# EAGLE design alu (EAGLE 9.5.1)
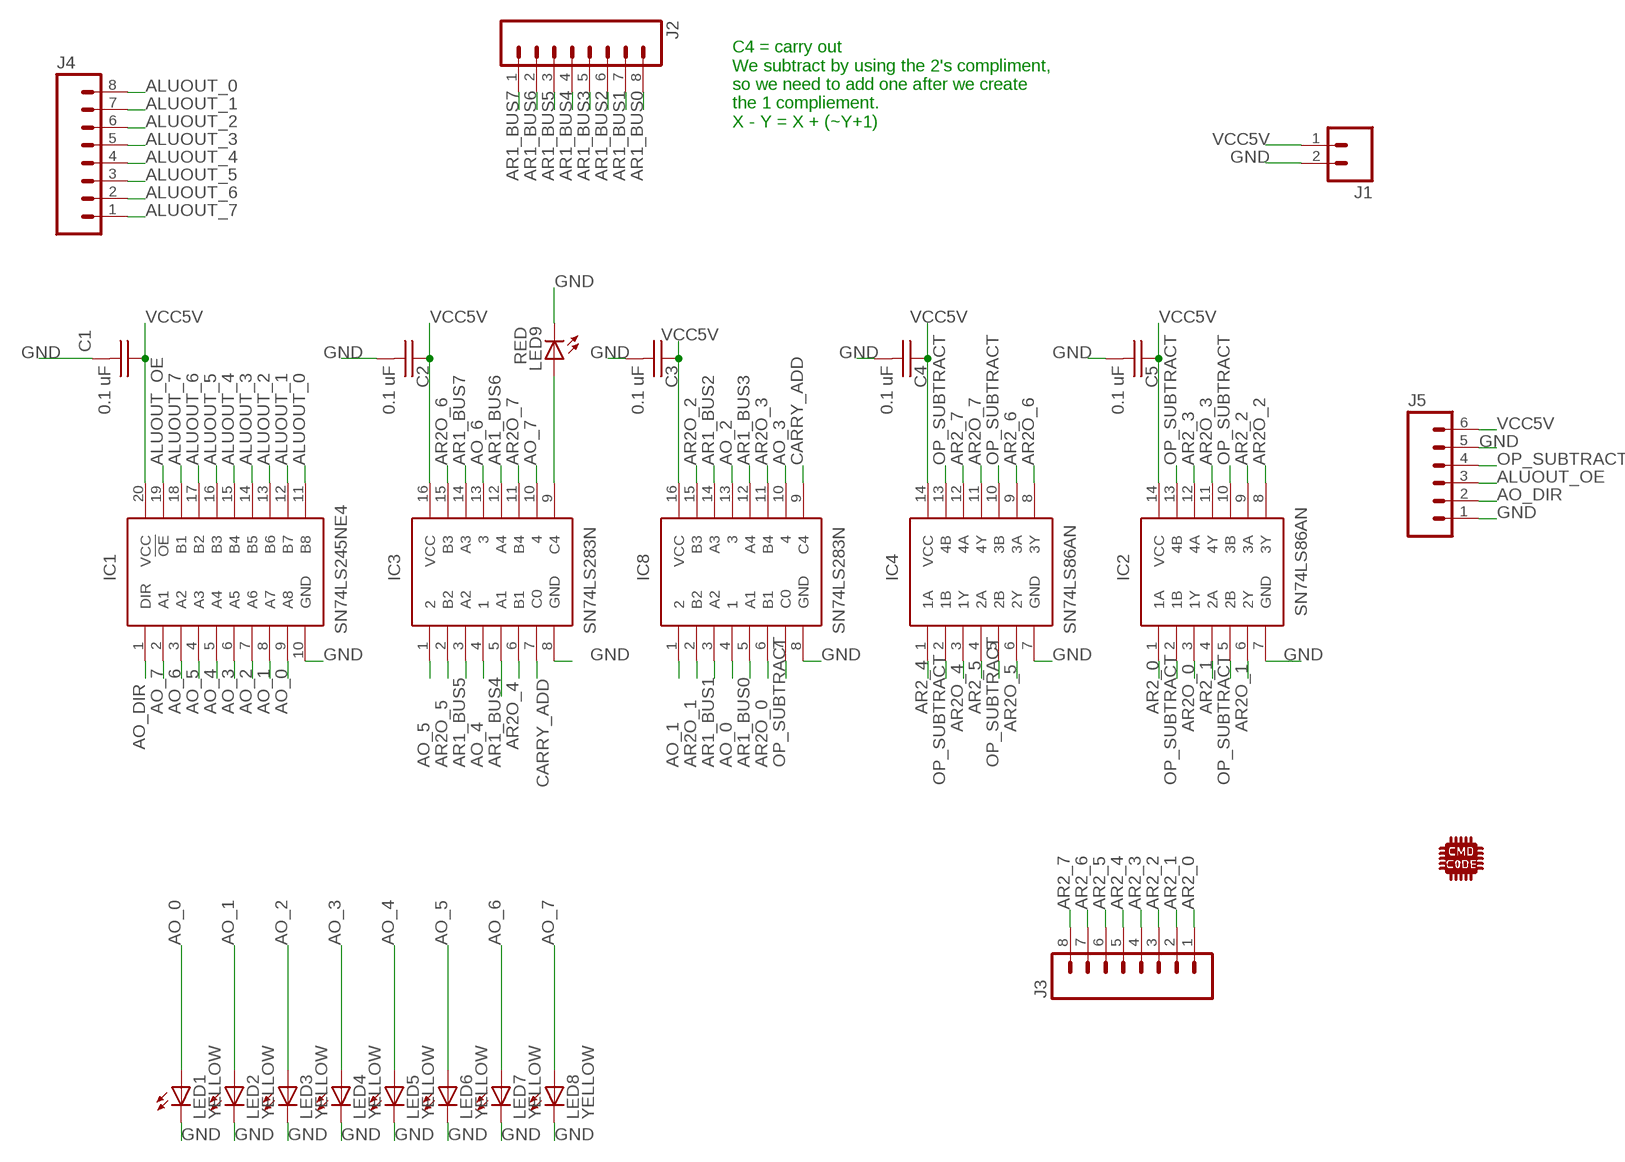
[diagram p0: schematic, sheet 1]

## Parts
C1  0.1 uF  C-US050-025X075  [C050-025X075]
C2  0.1 uF  C-US050-025X075  [C050-025X075]
C3  0.1 uF  C-US050-025X075  [C050-025X075]
C4  0.1 uF  C-US050-025X075  [C050-025X075]
C5  0.1 uF  C-US050-025X075  [C050-025X075]
IC1  SN74LS245NE4  [DIP794W53P254L2540H508Q20N]
IC2  SN74LS86AN  [DIP254P762X508-14]
IC3  SN74LS283N  [DIP254P762X508-16]
IC4  SN74LS86AN  [DIP254P762X508-14]
IC8  SN74LS283N  [DIP254P762X508-16]
J1  M02PTH  [1X02]
J2  M08SILK_FEMALE_PTH  [1X08]
J3  M08SILK_FEMALE_PTH  [1X08]
J4  M08SILK_FEMALE_PTH  [1X08]
J5  M06SILK_FEMALE_PTH  [1X06]
LED1  YELLOW  LED-3MM-NO_SILK  [LED3MM-NS]
LED2  YELLOW  LED-3MM-NO_SILK  [LED3MM-NS]
LED3  YELLOW  LED-3MM-NO_SILK  [LED3MM-NS]
LED4  YELLOW  LED-3MM-NO_SILK  [LED3MM-NS]
LED5  YELLOW  LED-3MM-NO_SILK  [LED3MM-NS]
LED6  YELLOW  LED-3MM-NO_SILK  [LED3MM-NS]
LED7  YELLOW  LED-3MM-NO_SILK  [LED3MM-NS]
LED8  YELLOW  LED-3MM-NO_SILK  [LED3MM-NS]
LED9  RED  LED-3MM-NO_SILK  [LED3MM-NS]
U$1  CMD_C0DE_LOGOCMD_CODE_LOGO_TOP_COPPER  [CMD_C0DE_LOGO_TOP_COPPER]

## Nets
ALUOUT_0: IC1.11(B8) J4.8
ALUOUT_1: IC1.12(B7) J4.7
ALUOUT_2: IC1.13(B6) J4.6
ALUOUT_3: IC1.14(B5) J4.5
ALUOUT_4: IC1.15(B4) J4.4
ALUOUT_5: IC1.16(B3) J4.3
ALUOUT_6: IC1.17(B2) J4.2
ALUOUT_7: IC1.18(B1) J4.1
ALUOUT_OE: IC1.19(!OE) J5.3
AO_0: IC1.9(A8) IC8.4 LED1.A
AO_1: IC1.8(A7) IC8.1 LED2.A
AO_2: IC1.7(A6) IC8.13 LED3.A
AO_3: IC1.6(A5) IC8.10 LED4.A
AO_4: IC1.5(A4) IC3.4 LED5.A
AO_5: IC1.4(A3) IC3.1 LED6.A
AO_6: IC1.3(A2) IC3.13 LED7.A
AO_7: IC1.2(A1) IC3.10 LED8.A
AO_DIR: IC1.1(DIR) J5.2
AR1_BUS0: IC8.5(A1) J2.8
AR1_BUS1: IC8.3(A2) J2.7
AR1_BUS2: IC8.14(A3) J2.6
AR1_BUS3: IC8.12(A4) J2.5
AR1_BUS4: IC3.5(A1) J2.4
AR1_BUS5: IC3.3(A2) J2.3
AR1_BUS6: IC3.12(A4) J2.2
AR1_BUS7: IC3.14(A3) J2.1
AR2_0: IC2.1(1A) J3.1
AR2_1: IC2.4(2A) J3.2
AR2_2: IC2.9(3A) J3.3
AR2_3: IC2.12(4A) J3.4
AR2_4: IC4.1(1A) J3.5
AR2_5: IC4.4(2A) J3.6
AR2_6: IC4.9(3A) J3.7
AR2_7: IC4.12(4A) J3.8
AR2O_0: IC2.3(1Y) IC8.6(B1)
AR2O_1: IC2.6(2Y) IC8.2(B2)
AR2O_2: IC2.8(3Y) IC8.15(B3)
AR2O_3: IC2.11(4Y) IC8.11(B4)
AR2O_4: IC3.6(B1) IC4.3(1Y)
AR2O_5: IC3.2(B2) IC4.6(2Y)
AR2O_6: IC3.15(B3) IC4.8(3Y)
AR2O_7: IC3.11(B4) IC4.11(4Y)
CARRY_ADD: IC3.7(C0) IC8.9(C4)
GND: C1.2 C2.2 C3.2 C4.2 C5.2 IC1.10(GND) IC2.7(GND) IC3.8(GND) IC4.7(GND) IC8.8(GND) J1.2 J5.1 J5.5 LED1.K(C) LED2.K(C) LED3.K(C) LED4.K(C) LED5.K(C) LED6.K(C) LED7.K(C) LED8.K(C) LED9.K(C)
N$10: IC3.9(C4) LED9.A
OP_SUBTRACT: IC2.2(1B) IC2.5(2B) IC2.10(3B) IC2.13(4B) IC4.2(1B) IC4.5(2B) IC4.10(3B) IC4.13(4B) IC8.7(C0) J5.4
VCC5V: C1.1 C2.1 C3.1 C4.1 C5.1 IC1.20(VCC) IC2.14(VCC) IC3.16(VCC) IC4.14(VCC) IC8.16(VCC) J1.1 J5.6

## Notes on the sheet
- C4 = carry out
  We subtract by using the 2's compliment, 
  so we need to add one after we create 
  the 1 compliement. 
  X - Y = X + (~Y+1)

## Library data of the parts
C1-C5 = passives:C-US: CAPACITOR, American symbol
IC1 = ICs:SN74LS245NE4: Bus Transceivers Octal bus Transceiver Source: Datasheet <http://www.ti.com/lit/ds/symlink/sn74ls245.pdf>; DESCRIPTION: Bus Transceivers Octal bus Transceiver; HEIGHT: 5.08mm; MANUFACTURER_NAME: Texas Instruments; MANUFACTURER_PART_NUMBER: SN74LS245NE4; MOUSER_PART_NUMBER: 595-SN74LS245NE4; MOUSER_PRICE-STOCK: https://www.mouser.com/Search/Refine.aspx?Keyword=595-SN74LS245NE4
IC2 IC4 = ICs:SN74LS86AN: QUADRUPLE 2-INPUT EXCLUSIVE-OR GATES Source: Datasheet <http://componentsearchengine.com/Datasheets/1/SN74LS86AN.pdf>; DESCRIPTION: QUADRUPLE 2-INPUT EXCLUSIVE-OR GATES; HEIGHT: mm; MANUFACTURER_NAME: Texas Instruments; MANUFACTURER_PART_NUMBER: SN74LS86AN; MOUSER_PART_NUMBER: 595-SN74LS86AN; MOUSER_PRICE-STOCK: https://www.mouser.com/Search/Refine.aspx?Keyword=595-SN74LS86AN; RS_PART_NUMBER: 3686641; RS_PRICE-STOCK: http://uk.rs-online.com/web/p/products/3686641
IC3 IC8 = ICs:SN74LS283N: 4-BIT BINARY FULL ADDERS WITH FASR CARRY Source: Datasheet <http://www.ti.com/lit/gpn/sn74ls283>; DESCRIPTION: 4-BIT BINARY FULL ADDERS WITH FASR CARRY; HEIGHT: mm; MANUFACTURER_NAME: Texas Instruments; MANUFACTURER_PART_NUMBER: SN74LS283N; MOUSER_PART_NUMBER: 595-SN74LS283N; MOUSER_PRICE-STOCK: https://www.mouser.com/Search/Refine.aspx?Keyword=595-SN74LS283N; RS_PART_NUMBER: 0309212; RS_PRICE-STOCK: http://uk.rs-online.com/web/p/products/0309212
J1 = connector:M02: Standard 2-pin 0.1" header. Use with - straight break away headers ( PRT-00116) - right angle break away headers (PRT-00553) - swiss pins (PRT-00743) - machine pins (PRT-00117) - female headers (PRT-00115) Molex polarized connector foot print use with: PRT-08233 with associated crimp pins and housings. 2.54_SCREWTERM for use with PRT-10571. 3.5mm Screw Terminal footprints for PRT-08084 5mm Screw Terminal footprints for use with PRT-08432
J2-J4 = connector:M08: Header 8 Standard 8-pin 0.1" header. Use with straight break away headers (SKU : PRT-00116), right angle break away headers (PRT-00553), swiss pins (PRT-00743), machine pins (PRT-00117), and female headers (PRT-00115).; PROD_ID: CONN-08438
J5 = connector:M06: Header 6 Standard 6-pin 0.1" header. Use with straight break away headers (SKU : PRT-00116), right angle break away headers (PRT-00553), swiss pins (PRT-00743), machine pins (PRT-00117), and female headers (PRT-00115). Molex polarized connector foot print use with SKU : PRT-08094 with associated crimp pins and housings. NOTES ON THE VARIANTS LOCK and LOCK_LONGPADS... This footprint was designed to help hold the alignment of a through-hole component (i.e. 6-pin header) while soldering it into place. You may notice that each hole has been shifted either up or down by 0.005 of an inch from it's more standard position (which is a perfectly straight line). This slight alteration caused the pins (the squares in the middle) to touch the edges of the holes. Because they are alternating, it causes a "brace" to hold the component in place. 0.005 has proven to be the perfect amount of "off-center" position when using our standard breakaway headers. Although looks a little odd when you look at the bare footprint, once you have a header in there, the alteration is very hard to notice. Also,if you push a header all the way into place, it is covered up entirely on the bottom side. This idea of altering the position of holes to aid alignment will be further integrated into the Sparkfun Library for other footprints. It can help hold any component with 3 or more connection pins.; PROD_ID: CONN-08437
LED1-LED9 = leds:LED: LEDs Standard schematic elements and footprints for 5mm, 3mm, 1206, and 0603 sized LEDs. 5mm - Spark Fun Electronics SKU : COM-00529 (and others)
U$1 = logos:CMD_C0DE_LOGO

## Board
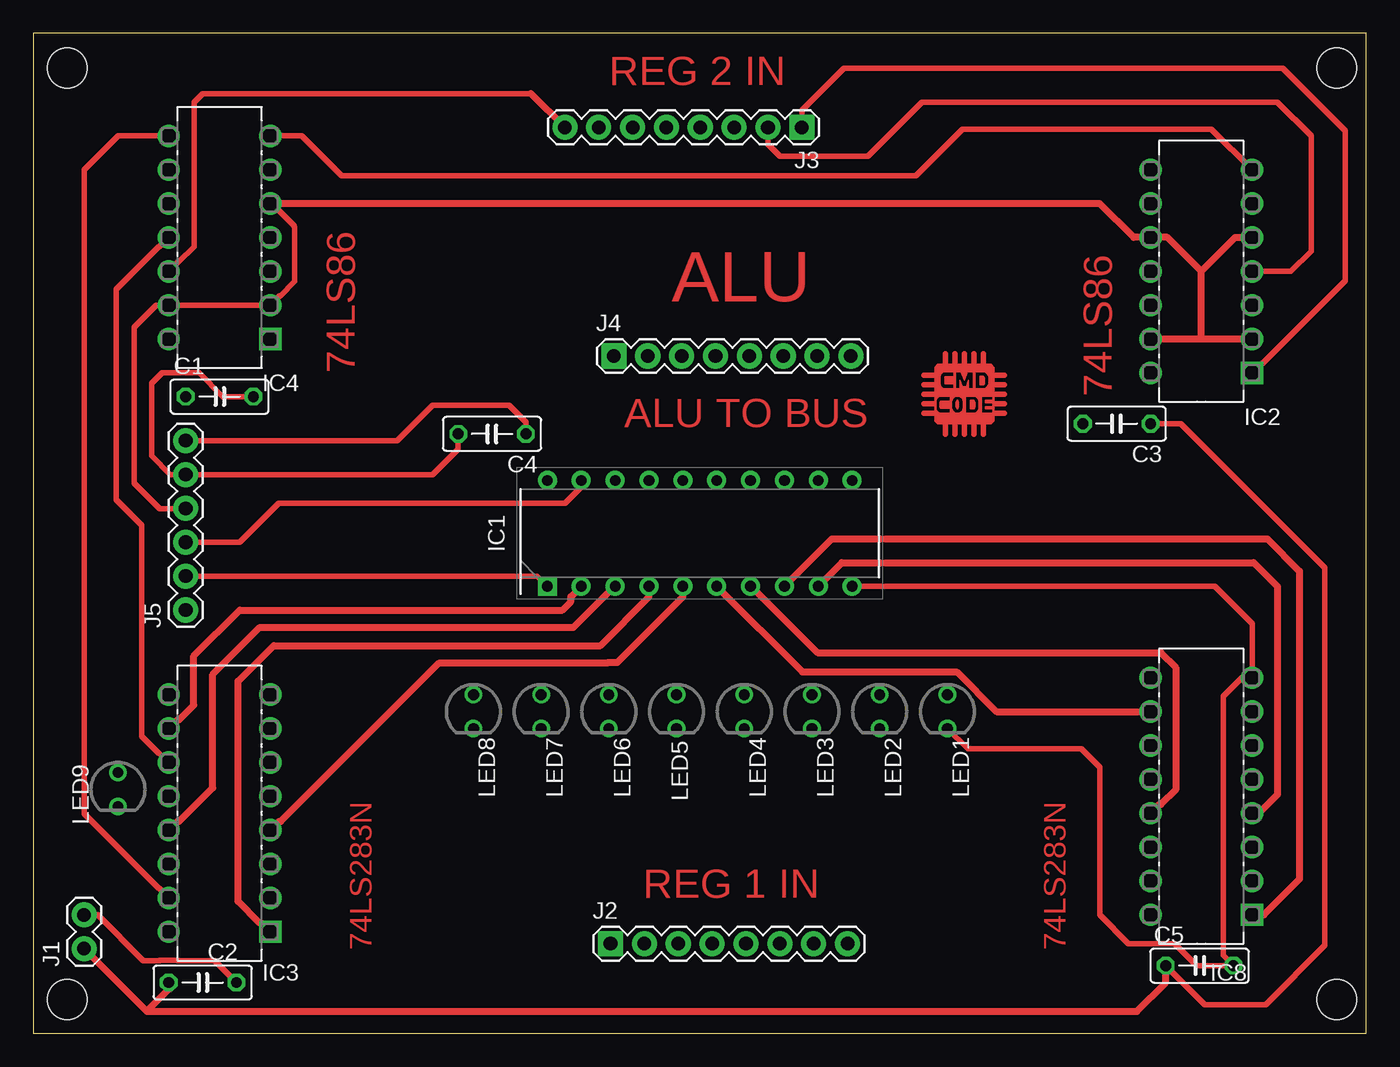
[diagram p1: board, top side]
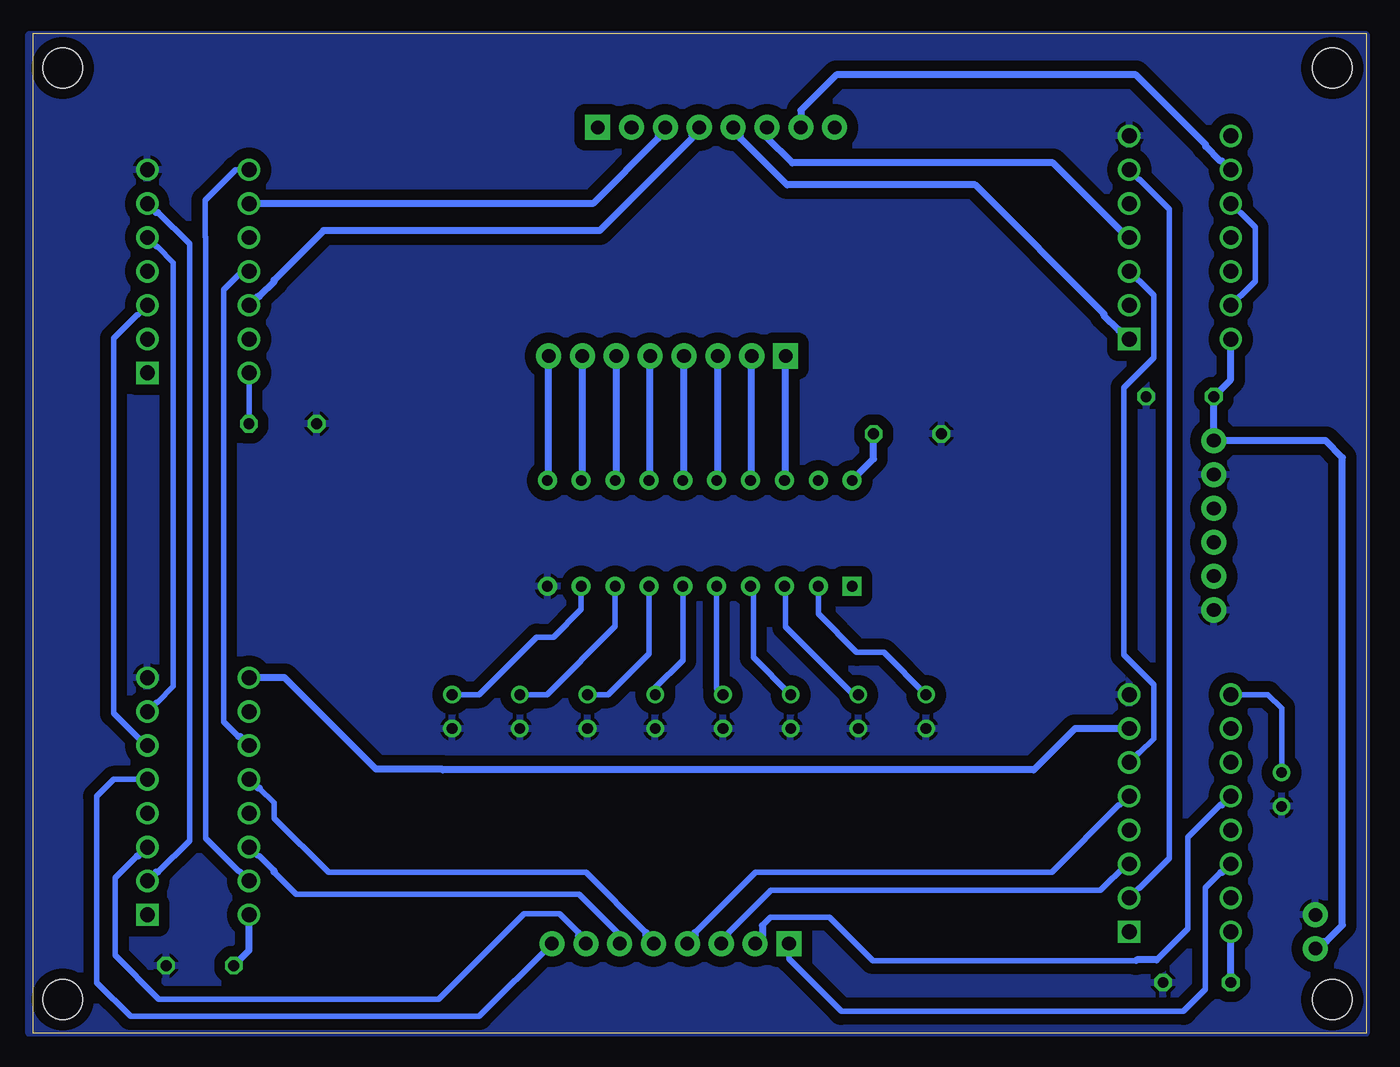
[diagram p2: board, bottom side, seen from below]

Size 100 x 75 mm. Coordinates in mm from the lower left corner, seen from the top.
Outline: 0,0 100,0 100,75 0,75 0,0
Copper layers (1*16): Top 0.035mm / dielectric 1.5mm / Bottom 0.035mm
Design rules "bantam-1-32-dadandson": minimum track width 0.4mm, minimum drill 0.8mm, track to track 0.794003125mm, track to pad 0.794003125mm, pad to pad 0.256540625mm, via to via 0.256540625mm, smd to smd 0mil, copper to edge 0mil, drill to drill 1mil, minimum pad ring 10mil, minimum via ring 10mil, stop-mask expansion 1mil, vias tented up to drill 30mil, thermal gap 10mil
Holes 3 mm at 2.54,2.54 2.54,72.39 97.79,72.39 97.79,2.54

### Footprints (pad centres in the part's own frame; a part is rotated, then mirrored left to right if it is on the bottom)
C050-025X075 = drill 0.813 octagon: 1 -2.54,0; 2 2.54,0
DIP794W53P254L2540H508Q20N = drill 0.8 pad 1.422 square: 1 -3.97,11.43 | drill 0.8 pad 1.422: 2 -3.97,8.89; 3 -3.97,6.35; 4 -3.97,3.81; 5 -3.97,1.27; 6 -3.97,-1.27; 7 -3.97,-3.81; 8 -3.97,-6.35; 9 -3.97,-8.89; 10 -3.97,-11.43; 11 3.97,-11.43; 12 3.97,-8.89; 13 3.97,-6.35; 14 3.97,-3.81; 15 3.97,-1.27; 16 3.97,1.27; 17 3.97,3.81; 18 3.97,6.35; 19 3.97,8.89; 20 3.97,11.43
DIP254P762X508-14 = drill 1.118 pad 1.676 square: 1 -7.62,15.24 | drill 1.118 pad 1.676: 2 -7.62,12.7; 3 -7.62,10.16; 4 -7.62,7.62; 5 -7.62,5.08; 6 -7.62,2.54; 7 -7.62,0; 8 0,0; 9 0,2.54; 10 0,5.08; 11 0,7.62; 12 0,10.16; 13 0,12.7; 14 0,15.24
DIP254P762X508-16 = drill 1.118 pad 1.676 square: 1 -7.62,17.78 | drill 1.118 pad 1.676: 2 -7.62,15.24; 3 -7.62,12.7; 4 -7.62,10.16; 5 -7.62,7.62; 6 -7.62,5.08; 7 -7.62,2.54; 8 -7.62,0; 9 0,0; 10 0,2.54; 11 0,5.08; 12 0,7.62; 13 0,10.16; 14 0,12.7; 15 0,15.24; 16 0,17.78
1X02 = drill 1.016 pad 1.88: 1 0,0; 2 2.54,0
1X08 = drill 1.016 pad 1.88 square: 1 0,0 | drill 1.016 pad 1.88: 2 2.54,0; 3 5.08,0; 4 7.62,0; 5 10.16,0; 6 12.7,0; 7 15.24,0; 8 17.78,0
1X06 = drill 1.016 pad 1.88: 1 0,0; 2 2.54,0; 3 5.08,0; 4 7.62,0; 5 10.16,0; 6 12.7,0
LED3MM-NS = drill 0.813: A -1.27,0; K 1.27,0

### Placement (x,y rotation side)
C1  13.97,47.75 0 top
C2  12.7,3.81 0 top
C3  81.28,45.72 180 top
C4  34.42,44.96 180 top
C5  87.5,5.08 0 top
IC1  50,37.5 90 top
IC2  83.82,64.77 180 top
IC3  10.16,25.4 180 top
IC4  10.16,67.31 180 top
IC8  83.82,26.67 180 top
J1  3.81,6.35 90 top
J2  43.31,6.73 0 top
J3  57.66,67.94 180 top
J4  43.56,50.8 0 top
J5  11.43,31.75 90 top
LED1  68.58,24.13 270 top
LED2  63.5,24.13 270 top
LED3  58.42,24.13 270 top
LED4  53.34,24.13 270 top
LED5  48.26,24.13 270 top
LED6  43.18,24.13 270 top
LED7  38.1,24.13 270 top
LED8  33.02,24.13 270 top
LED9  6.35,18.29 270 top
U$1  69.85,48.26 0 top

### Tracks (layer width: path | path; a pad name or v marks a point on that pad's centre or on a via)
ALUOUT_0
  Bottom 0.508: IC1.11 61.34,41.56 J4.8
ALUOUT_1
  Bottom 0.508: IC1.12 58.8,41.56 J4.7
ALUOUT_2
  Bottom 0.508: IC1.13 56.26,41.56 J4.6
ALUOUT_3
  Bottom 0.508: IC1.14 53.72,41.56 J4.5
ALUOUT_4
  Bottom 0.508: IC1.15 51.18,41.56 J4.4
ALUOUT_5
  Bottom 0.508: IC1.16 48.64,41.56 J4.3
ALUOUT_6
  Bottom 0.508: IC1.17 46.1,41.56 J4.2
ALUOUT_7
  Bottom 0.508: IC1.18 43.56,41.56 J4.1
ALUOUT_OE
  Top 0.4: J5.3 15.49,36.83 18.41,39.75 39.9,39.75 41.11,40.96
  Top 0.406: IC1.19 41.11,40.96
AO_0
  Top 0.508: IC1.9 60.67,35.31 91.57,35.31 93.34,33.53 93.34,17.91 91.95,16.51 IC8.4
  Bottom 0.406: LED1.A 66.55,25.4 62.23,29.72 60.96,29.72 58.89,31.79 IC1.9
AO_1
  Top 0.508: IC1.8 59.9,37.08 92.58,37.08 95,34.67 95,11.56 92.33,8.89 IC8.1
  Bottom 0.406: LED2.A 61.47,25.4 56.35,30.52 IC1.8
AO_2
  Top 0.508: IC1.7 53.86,33.53 58.84,28.56 84.6,28.56 85.71,27.45 85.71,18.27 84.6,17.16 84.47,17.16 IC8.13
  Bottom 0.406: LED3.A 56.9,25.4 53.81,28.49 IC1.7
AO_3
  Top 0.508: IC1.6 57.69,27.11 69.29,27.11 72.27,24.13 IC8.10
  Bottom 0.406: LED4.A 53.34,25.91 51.27,27.98 IC1.6
AO_4
  Top 0.508: IC3.4 18.43,15.89 18.56,15.89 30.45,27.78 43.08,27.78 43.12,27.81 43.81,27.81 48.73,32.73 IC1.5
  Bottom 0.406: LED5.A 48.73,25.87 IC1.5
AO_5
  Top 0.508: IC3.1 17.13,8.27 17,8.27 15.37,9.9 15.37,26.42 18.03,29.08 42.55,29.08 46.19,32.73 IC1.4
  Bottom 0.406: LED6.A 45.97,28.19 45.97,33.31 IC1.4
AO_6
  Top 0.508: IC3.13 10.81,15.89 10.94,15.89 13.46,18.41 13.46,26.92 16.99,30.45 40.52,30.45 43.6,33.53 IC1.3
  Bottom 0.406: LED7.A 38.48,25.4 43.56,30.48 43.56,33.44 IC1.3
AO_7
  Top 0.508: IC3.10 10.81,23.51 10.94,23.51 12.05,24.62 12.05,28.3 15.49,31.75 39.69,31.75 40.33,32.38 40.33,32.75 IC1.2
  Bottom 0.406: LED8.A 36.2,28.57 38.23,28.57 41.11,31.46 IC1.2
AO_DIR
  Top 0.4: J5.2 37.81,34.29 IC1.1
AR1_BUS0
  Bottom 0.406: IC8.5 93.98,19.05 95.25,17.78 95.25,3.81 92.71,1.27 66.55,1.27 J2.8
AR1_BUS1
  Bottom 0.406: IC8.3 92.09,13.32 | 92.22,13.32 93.85,11.68 93.85,5.84 90.58,2.57 69.58,2.57 63.18,8.97 60.52,8.97 59.1,7.55 | 59.1,7.28 J2.7
  Bottom 0.508: 92.09,13.32 92.22,13.32 | 59.1,7.55 59.1,7.28
AR1_BUS2
  Bottom 0.406: IC8.14 83.17,13.32 83.04,13.32 81.93,12.21 | 81.93,12.08 80.26,10.41 59.04,10.41 56.01,7.38 J2.6
  Bottom 0.508: 81.93,12.21 81.93,12.08
AR1_BUS3
  Bottom 0.406: J2.5 54.02,7.28 | 54.02,7.55 58.53,12.06 77.85,12.06 81.93,16.15 81.93,17.29 83.04,18.4 | 83.17,18.4 IC8.12
  Bottom 0.508: 54.02,7.28 54.02,7.55 | 83.04,18.4 83.17,18.4
AR1_BUS4
  Bottom 0.406: IC3.5 18.43,17.13 18.56,17.13 23.59,12.1 45.83,12.1 50.38,7.55 | 50.38,7.28 J2.4
  Bottom 0.508: 50.38,7.55 50.38,7.28
AR1_BUS5
  Bottom 0.406: J2.3 47.84,7.28 47.84,7.55 44.67,10.72 19.94,10.72 17.96,12.7 IC3.3
AR1_BUS6
  Bottom 0.406: IC3.12 10.81,17.13 | 10.94,17.13 13.37,14.7 13.37,7.86 15.71,5.52 | 17.27,5.46 37.02,5.46 40.28,8.72 44.68,8.72 45.3,8.11 | 45.3,7.28 J2.2
  Bottom 0.508: 10.81,17.13 10.94,17.13 | 17.27,5.46 17.22,5.52 15.71,5.52 | 45.3,8.11 45.3,7.28
AR1_BUS7
  Bottom 0.406: 10.94,12.05 12.06,10.92 12.06,3.3 13.72,1.65 39.37,1.65 43.31,5.59 J2.1
  Bottom 0.508: IC3.14 10.81,12.05 10.94,12.05
AR2_0
  Top 0.406: IC2.1 92.14,50.23 92.2,50.23 98.42,56.46 98.42,67.69 93.73,72.39 60.83,72.39 57.66,69.22 J3.1
AR2_1
  Top 0.406: J3.2 55.12,66.67 56.01,65.79 62.61,65.79 66.67,69.85 93.34,69.85 95.89,67.31 95.89,58.67 94.36,57.15 IC2.4
AR2_2
  Bottom 0.508: J3.3 53.13,67.39 53.13,67.12 58.02,62.23 IC2.9
AR2_3
  Bottom 0.508: J3.4 50.59,67.39 50.59,67.12 57.51,60.2 78.23,60.2 81.93,56.5 81.93,56.37 83.04,55.26 83.17,55.26 IC2.12
AR2_4
  Bottom 0.508: IC4.1 18.43,52.72 18.56,52.72 19.67,53.83 19.67,53.96 29.34,63.63 43.45,63.63 46.95,67.12 46.95,67.39 J3.5
AR2_5
  Bottom 0.508: IC4.4 17.91,59.69 23.5,65.28 43.05,65.28 44.96,67.18 J3.6
AR2_6
  Bottom 0.508: IC4.9 10.81,65.42 10.94,65.42 12.05,66.53 12.05,66.66 17.27,71.88 39.75,71.88 42.42,69.22 J3.7
AR2_7
  Top 0.4: IC4.12 10.87,57.86 10.92,57.86 12.06,59 12.06,69.85 12.7,70.48 37.34,70.48
  Top 0.508: 37.34,70.48 J3.8
AR2O_0
  Bottom 0.4: IC2.3 92.15,53.9 92.2,53.9 93.98,52.12
  Bottom 0.406: 91.57,21.59 93.98,24 93.98,52.12
  Bottom 0.508: 91.57,21.59 IC8.6
AR2O_1
  Bottom 0.406: 90.66,12.08 88.28,14.46 88.28,59.2 90.66,61.58 | IC2.6 90.79,61.58
  Bottom 0.508: IC8.2 90.79,12.08 90.66,12.08 | 90.79,61.58 90.66,61.58
AR2O_2
  Bottom 0.4: IC8.15 84.53,12.14 84.58,12.14 87.09,14.64 87.09,59.7 87.12,59.73 87.12,62.48 84.84,64.77 IC2.8
AR2O_3
  Bottom 0.4: 84.6,22.24 85.72,23.37 85.72,55.75 84.33,57.15
  Bottom 0.508: IC8.11 84.47,22.24 84.6,22.24 | 84.33,57.15 IC2.11
AR2O_4
  Bottom 0.4: IC4.3 17.07,56.44 17.02,56.44 15.95,55.37 15.95,50.65 18.16,48.44 18.16,28.38 15.95,26.16 15.95,22.1 17.02,21.03 17.07,21.03 IC3.6
AR2O_5
  Bottom 0.406: IC3.2 17.07,10.87 17.02,10.87 14.75,13.13 14.75,61.8 17.02,64.06 17.07,64.06 IC4.6
AR2O_6
  Top 0.406: IC3.15 9.46,10.87 9.4,10.87 3.81,16.45 3.81,64.77 6.35,67.31 IC4.8
AR2O_7
  Top 0.406: IC3.11 9.46,21.02 9.4,21.02 8.13,22.3 8.13,38.11 6.24,40 6.24,55.82 9.4,58.98 9.46,58.98 IC4.11
CARRY_ADD
  Bottom 0.508: IC3.7 21.84,22.86 24.95,19.75 69.29,19.75 69.34,19.81 74.3,19.81 81.15,26.67 IC8.9
GND
  Top 0.4: C5.2 87.3,5.08 85.65,6.73 82.17,6.73 80.01,8.89 80.01,19.94 78.61,21.34 70.1,21.34 LED1.K | IC1.10 88.64,33.53 91.44,30.73 IC8.8 | IC2.7 88.39,67.82 69.72,67.82 66.21,64.31 23.11,64.31 20.12,67.31 IC4.7 | J5.5 29.97,41.91 31.88,43.81 C4.2 | J1.2 4.83,8.89 8.26,5.46 9.47,5.46 10.85,5.46 13.59,5.46 C2.2
  Top 0.406: C5.2 89.28,5.84 89.28,25.27 90.68,26.67 IC8.8 | C1.2 14.22,47.75 12.45,49.53 9.65,49.53 8.89,48.77 8.89,43.31 10.29,41.91 J5.5
  pour Bottom (isolate 0.813): 0,74.93 0,0 100.33,0 100.33,74.93
N$10
  Bottom 0.406: LED9.A 6.35,24.38 7.37,25.4 IC3.9
OP_SUBTRACT
  Top 0.4: IC4.2 18.49,55.32 18.54,55.32 19.61,56.39 19.61,60.45 19.56,60.5 19.56,60.58 17.91,62.23 IC4.5
  Top 0.406: J5.4 10.73,39.37 10.7,39.34 9.48,39.34 7.56,41.26 7.56,52.96 9.21,54.61 IC4.13 IC4.2
  Top 0.508: IC2.2 87.63,52.07 | 87.63,52.07 IC2.13 | 87.63,52.07 87.63,57.15 | 87.63,57.15 90.17,59.69 IC2.5 | 87.63,57.15 85.09,59.69 IC2.10 82.55,59.69 80.01,62.23 IC4.5
  Bottom 0.4: IC8.7 90.73,24.84 90.68,24.84 89.5,26.02 89.5,57.8 90.68,58.98 90.73,58.98 IC2.5
  Bottom 0.406: IC4.13 9.46,55.31 9.4,55.31 8.32,56.39 8.32,60.45 9.4,61.52 9.46,61.52 IC4.10
VCC5V
  Top 0.406: C4.1 36.96,45.85 35.69,47.12 29.97,47.12 27.3,44.45 J5.6 | C5.1 87.88,2.16 92.46,2.16 96.9,6.6 96.9,34.92 86.11,45.72 C3.1
  Top 0.508: 8.51,1.65 82.8,1.65 84.96,3.81 C5.1 | J1.1 8.51,1.65 | C2.1 10.16,3.3 8.51,1.65
  Bottom 0.406: C3.1 IC2.14
  Bottom 0.508: C2.1 IC3.16 | IC4.14 10.16,49.02 C1.1 J5.6 3.05,44.45 1.78,43.18 1.78,8.11 2.99,6.9 3.26,6.9 J1.1 | C5.1 83.82,6.22 IC8.16 | IC1.20 36.96,43.08 C4.1

### Text on the board
Top: REG 2 IN | 74LS86 | ALU | 74LS86 | ALU TO BUS | REG 1 IN | 74LS283N | 74LS283N